# EAGLE design weatherstationv2 (EAGLE 6.0)
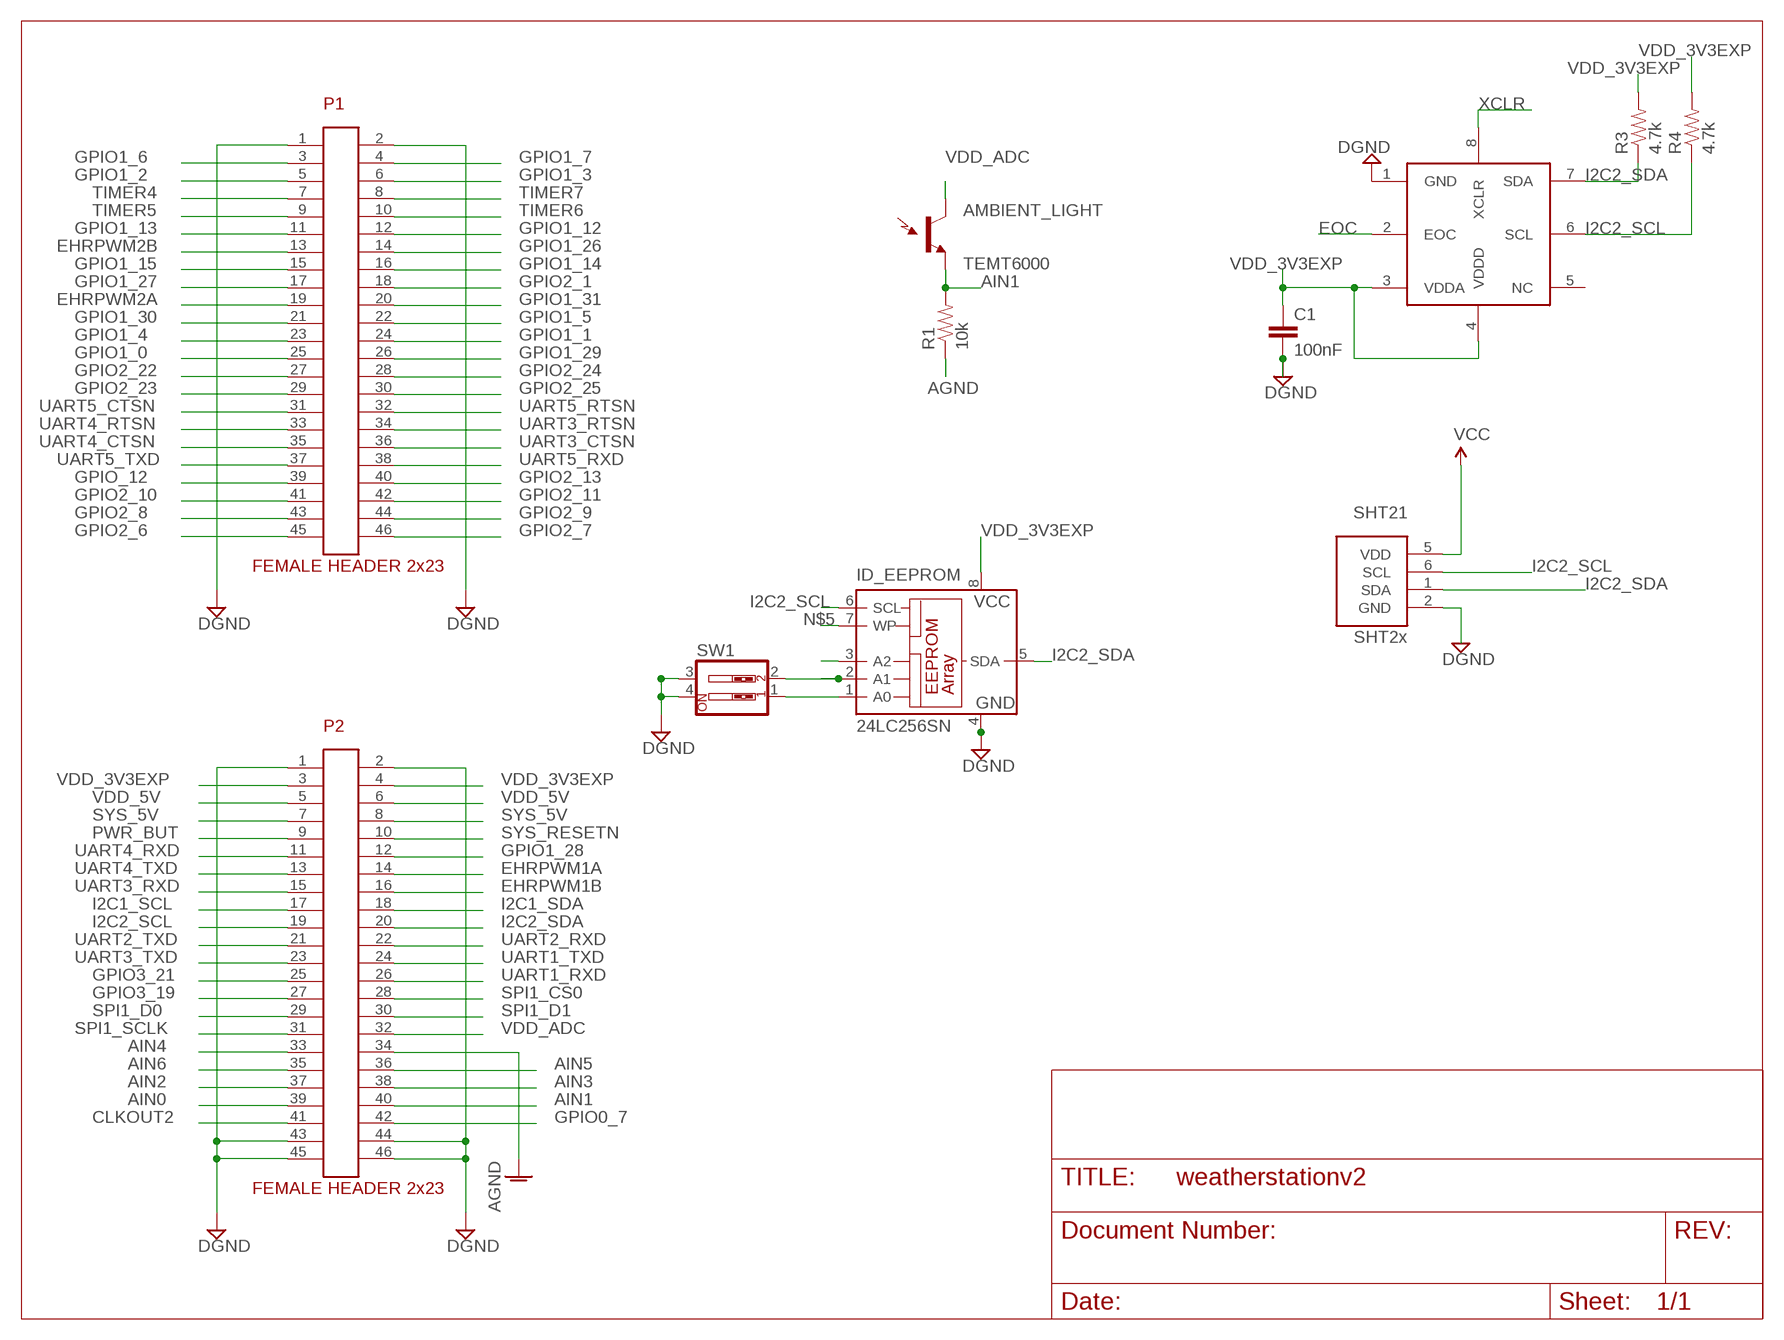
[diagram p0: schematic, sheet 1]

## Parts
AMBIENT_LIGHT  TEMT6000  [TEMT6000-SEN]
BAROMETRIC_PRESSURE  BMP085  [BMP085]
C1  100nF  CAP0603-CAP  [0603-CAP]
ID_EEPROM  24LC256SN  [SO-08]
P1  CONN23-2F  [CONN23-2F]
P2  CONN23-2FB  [CONN23-2F]
R1  10k  RESISTOR0805-RES  [0805]
R3  4.7k  RESISTOR0603-RES  [0603-RES]
R4  4.7k  RESISTOR0603-RES  [0603-RES]
SHT21  SHT2x  SHT21  [SHT21]
SW1  SW_DIP-2  [DIPSWITCH-02]

## Nets
AGND: P2.34 R1.1
AIN0: P2.39
AIN1: AMBIENT_LIGHT.EMITTER(E1) P2.40 R1.2
AIN2: P2.37
AIN3: P2.38
AIN4: P2.33
AIN5: P2.36
AIN6: P2.35
CLKOUT2: P2.41
DGND [power]: BAROMETRIC_PRESSURE.1(GND) C1.2 P1.1 P1.2 P2.1 P2.2 P2.43 P2.44 P2.45 P2.46 SHT21.2(GND) SW1.3 SW1.4
EHRPWM1A: P2.14
EHRPWM1B: P2.16
EHRPWM2A: P1.19
EHRPWM2B: P1.13
EOC: BAROMETRIC_PRESSURE.2(EOC)
GPIO0_7: P2.42
GPIO1_0: P1.25
GPIO1_1: P1.24
GPIO1_2: P1.5
GPIO1_3: P1.6
GPIO1_4: P1.23
GPIO1_5: P1.22
GPIO1_6: P1.3
GPIO1_7: P1.4
GPIO1_12: P1.12
GPIO1_13: P1.11
GPIO1_14: P1.16
GPIO1_15: P1.15
GPIO1_26: P1.14
GPIO1_27: P1.17
GPIO1_28: P2.12
GPIO1_29: P1.26
GPIO1_30: P1.21
GPIO1_31: P1.20
GPIO2_1: P1.18
GPIO2_6: P1.45
GPIO2_7: P1.46
GPIO2_8: P1.43
GPIO2_9: P1.44
GPIO2_10: P1.41
GPIO2_11: P1.42
GPIO2_13: P1.40
GPIO2_22: P1.27
GPIO2_23: P1.29
GPIO2_24: P1.28
GPIO2_25: P1.30
GPIO3_19: P2.27
GPIO3_21: P2.25
GPIO_12: P1.39
I2C1_SCL: P2.17
I2C1_SDA: P2.18
I2C2_SCL: BAROMETRIC_PRESSURE.6(SCL) ID_EEPROM.6(SCL) P2.19 R4.1 SHT21.6(SCL)
I2C2_SDA: BAROMETRIC_PRESSURE.7(SDA) ID_EEPROM.5(SDA) P2.20 R3.1 SHT21.1(SDA)
N$1: ID_EEPROM.1(A0) SW1.1
N$5: ID_EEPROM.7(WP)
N$6: ID_EEPROM.3(A2)
N$7: ID_EEPROM.2(A1) SW1.2
PWR_BUT: P2.9
SPI1_CS0: P2.28
SPI1_D0: P2.29
SPI1_D1: P2.30
SPI1_SCLK: P2.31
SYS_5V: P2.7 P2.8
SYS_RESETN: P2.10
TIMER4: P1.7
TIMER5: P1.9
TIMER6: P1.10
TIMER7: P1.8
UART1_RXD: P2.26
UART1_TXD: P2.24
UART2_RXD: P2.22
UART2_TXD: P2.21
UART3_CTSN: P1.36
UART3_RTSN: P1.34
UART3_RXD: P2.15
UART3_TXD: P2.23
UART4_CTSN: P1.35
UART4_RTSN: P1.33
UART4_RXD: P2.11
UART4_TXD: P2.13
UART5_CTSN: P1.31
UART5_RTSN: P1.32
UART5_RXD: P1.38
UART5_TXD: P1.37
VDD_3V3EXP [power]: BAROMETRIC_PRESSURE.3(VDDA) BAROMETRIC_PRESSURE.4(VDDD) C1.1 ID_EEPROM.8(VCC) P2.3 P2.4 R3.2 R4.2 SHT21.5(VDD) ; supply symbol labelled VCC
VDD_5V: P2.5 P2.6
VDD_ADC [power]: AMBIENT_LIGHT.COLLECTOR(C1) P2.32
XCLR: BAROMETRIC_PRESSURE.8(XCLR)
Unconnected: BAROMETRIC_PRESSURE.5(NC)

## Power pins joined to a net without a drawn wire
DGND: ID_EEPROM.4(GND)

## Library data of the parts
AMBIENT_LIGHT = SparkFun:TEMT6000: Ambient Light Sensor Simple light detection sensor. Output varies with light intensity input. Spark Fun Electronics SKU : COM-08348
BAROMETRIC_PRESSURE = SparkFun:BMP085
C1 = SparkFun:CAP: Capacitor Standard 0603 ceramic capacitor, and 0.1" leaded capacitor.
ID_EEPROM = microchip:24*: Serial EEPROM I2C; MF: MICROCHIP; MPN: 24LC256-I/SN; OC_FARNELL: 9757996; OC_NEWARK: 27C9144
P1 = conn23-2f:CONN23-2F: CONN23-2F 23x2 pin female header
P2 = conn23-2f:CONN23-2FB: CONN23-2FB 2x23 pin female header
R1 R3 R4 = SparkFun:RESISTOR: Resistor Basic schematic elements and footprints for 0603, 1206, and PTH resistors.
SHT21 = ALX:SHT21
SW1 = SparkFun:SW_DIP-2: DIP SWITCH

## Net classes
1 power: width 0.61 mm

## Board
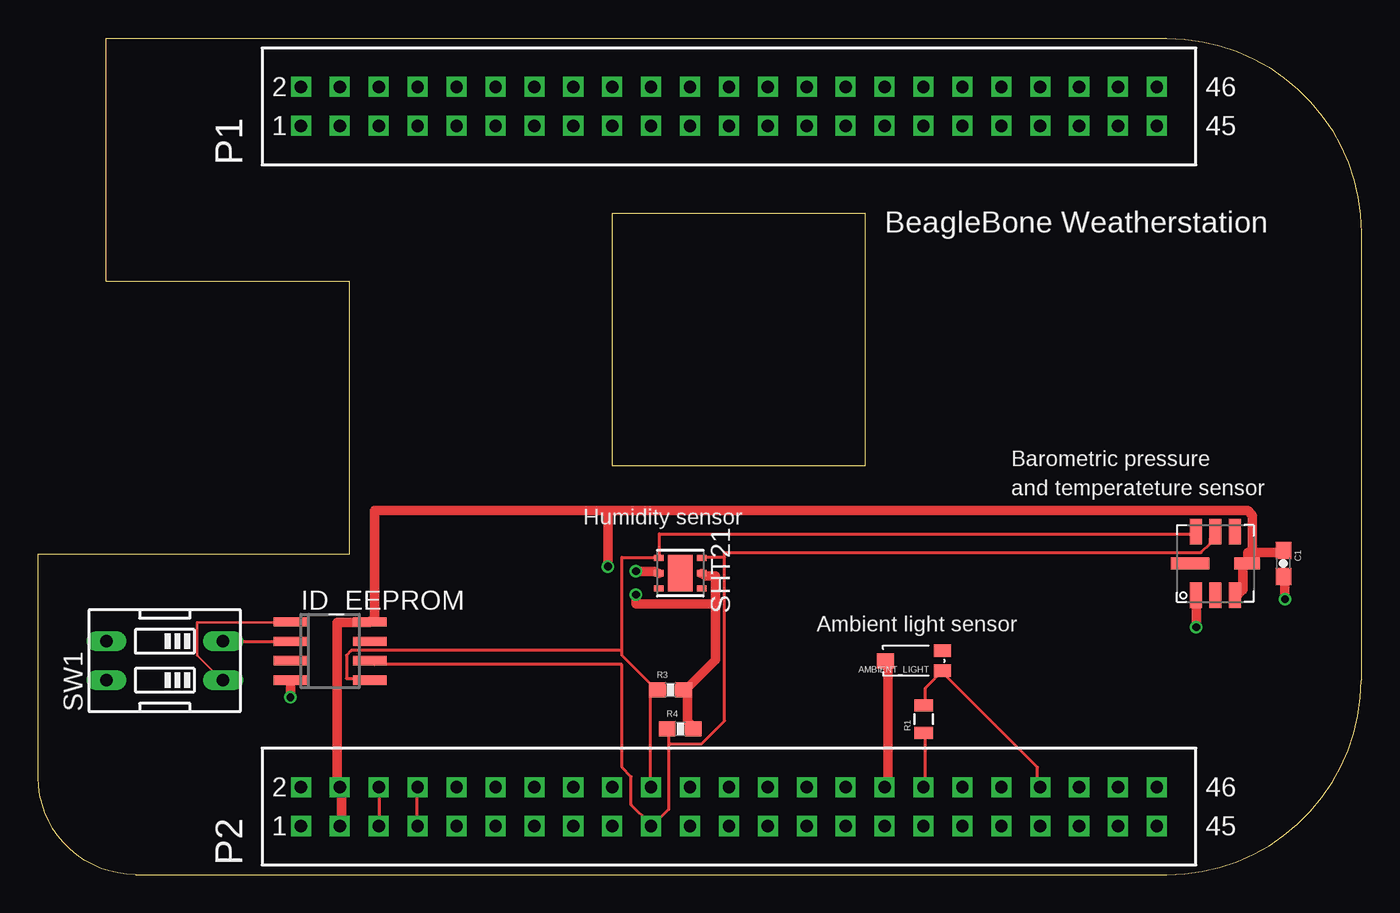
[diagram p1: board, top side]
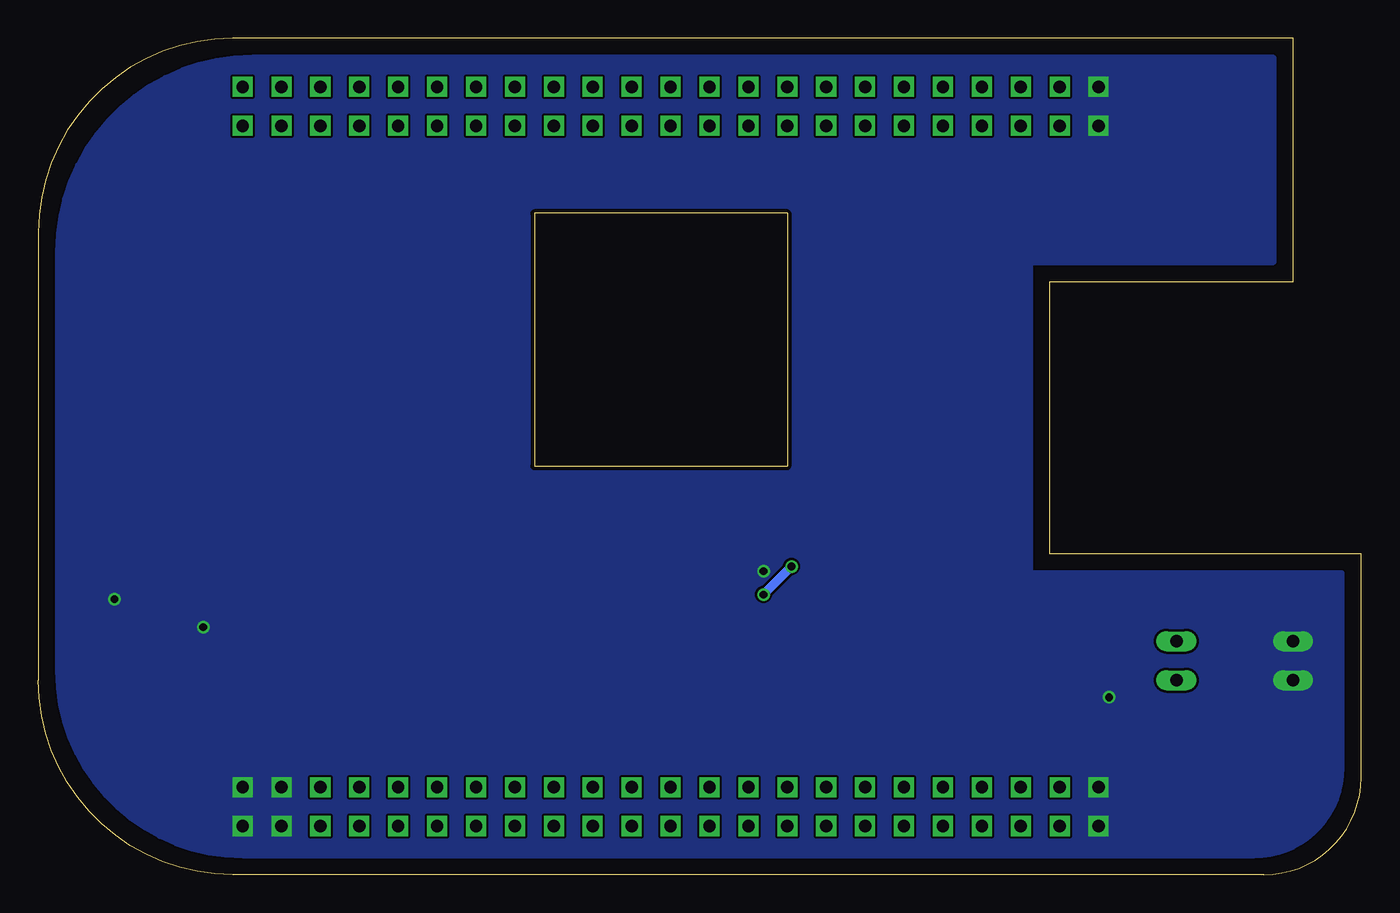
[diagram p2: board, bottom side, seen from below]

Size 86.36 x 54.61 mm. Coordinates in mm from the lower left corner, seen from the top.
Outline: 73.66,0 arc90 86.36,12.7 86.36,41.91 arc90 73.66,54.61 4.45,54.61 4.45,38.73 20.32,38.73 20.32,20.95 0,20.95 0,6.35 arc90 6.35,0 73.66,0
Outline: 37.47,43.18 53.98,43.18 53.98,26.67 37.47,26.67 37.47,43.18
Copper layers (1*16): Top 0.035mm / dielectric 1.5mm / Bottom 0.035mm
Design rules: minimum track width 6mil, minimum drill 12mil, track to track 6mil, track to pad 6mil, pad to pad 6mil, via to via 6mil, smd to smd 0mil, copper to edge 10mil, drill to drill 10mil, minimum pad ring 10mil, minimum via ring 6mil, stop-mask expansion 2mil, vias tented up to drill 100mil, thermal gap 10mil

### Footprints (pad centres in the part's own frame; a part is rotated, then mirrored left to right if it is on the bottom)
TEMT6000-SEN = smd 1.1 x 0.8: BASE -1.87,-0.65; EMITTER -1.87,0.65 | smd 1.1 x 1: COLLECTOR 1.86,0.01
BMP085 = smd 1.67 x 0.8: 1 -2.065,1.27; 2 -2.065,0; 3 -2.065,-1.27; 5 2.065,-1.27; 6 2.065,0; 7 2.065,1.27 | smd 0.8 x 1.67: 4 0,-2.065 | smd 0.8 x 2.5: 8 0,1.65
0603-CAP = smd 1.1 x 1: 1 -0.85,0; 2 0.85,0
SO-08 = smd 0.6 x 2.2: 1 -1.905,-2.6; 2 -0.635,-2.6; 3 0.635,-2.6; 4 1.905,-2.6; 5 1.905,2.6; 6 0.635,2.6; 7 -0.635,2.6; 8 -1.905,2.6
CONN23-2F = drill 0.8 square: 1 -1.27,27.94; 2 1.27,27.94; 3 -1.27,25.4; 4 1.27,25.4; 5 -1.27,22.86; 6 1.27,22.86; 7 -1.27,20.32; 8 1.27,20.32; 9 -1.27,17.78; 10 1.27,17.78; 11 -1.27,15.24; 12 1.27,15.24; 13 -1.27,12.7; 14 1.27,12.7; 15 -1.27,10.16; 16 1.27,10.16; 17 -1.27,7.62; 18 1.27,7.62; 19 -1.27,5.08; 20 1.27,5.08; 21 -1.27,2.54; 22 1.27,2.54; 23 -1.27,0; 24 1.27,0; 25 -1.27,-2.54; 26 1.27,-2.54; 27 -1.27,-5.08; 28 1.27,-5.08; 29 -1.27,-7.62; 30 1.27,-7.62; 31 -1.27,-10.16; 32 1.27,-10.16; 33 -1.27,-12.7; 34 1.27,-12.7; 35 -1.27,-15.24; 36 1.27,-15.24; 37 -1.27,-17.78; 38 1.27,-17.78; 39 -1.27,-20.32; 40 1.27,-20.32; 41 -1.27,-22.86; 42 1.27,-22.86; 43 -1.27,-25.4; 44 1.27,-25.4; 45 -1.27,-27.94; 46 1.27,-27.94
0805 = smd 0.8 x 1.2: 1 -0.9,0; 2 0.9,0
0603-RES = smd 1.1 x 1: 1 -0.85,0; 2 0.85,0
SHT21 = smd 0.4 x 0.6: 1 -1,-1.4; 2 0,-1.4; 3 1,-1.4; 4 1,1.4; 5 0,1.4; 6 -1,1.4 | smd 2.4 x 1.6: P$7 0,0
DIPSWITCH-02 = drill 0.813 long: 1 -1.27,-3.81; 2 1.27,-3.81; 3 1.27,3.81; 4 -1.27,3.81

### Placement (x,y rotation side)
AMBIENT_LIGHT  57.15,13.97 180 top
BAROMETRIC_PRESSURE  76.83,20.32 90 top
C1  81.28,20.32 270 top
ID_EEPROM  19.05,14.61 270 top
P1  45.09,50.16 90 top
P2  45.09,4.45 90 top
R1  57.78,10.16 90 top
R3  41.27,12.06 0 top
R4  41.91,9.53 0 top
SHT21  41.91,19.68 270 top
SW1  8.26,13.97 90 top

### Tracks (layer width: path | path; a pad name or v marks a point on that pad's centre or on a via)
AGND
  Top 0.203: R1.1 57.91,9.14 57.91,5.79 P2.34
AIN1
  Top 0.203: R1.2 57.91,11.28 57.91,12.19 58.83,13.11 AMBIENT_LIGHT.EMITTER 59.13,13.11 65.23,7.01 65.23,5.79 P2.40
DGND  (via drill 0.51)
  Top 0.61: v39.01,19.81 40.23,19.81 SHT21.2 | v81.38,17.98 81.38,19.2 C1.2 | v75.59,16.15 75.59,17.98 BAROMETRIC_PRESSURE.1 | v16.46,11.58 16.46,12.5 ID_EEPROM.4
  pour Bottom (no thermals): 5.71,40.01 5.71,53.34 72.39,53.34 arc-90 85.09,40.64 85.09,13.34 arc-90 73.03,1.27 6.99,1.27 arc-90 1.27,6.99 1.27,19.68 21.59,19.68 21.59,40.01
I2C2_SCL
  Top 0.203: ID_EEPROM.6 21.95,13.72 38.1,13.72 38.1,7.01 38.71,6.4 38.71,4.57 39.93,3.35 P2.19 40.23,3.35 41.15,4.27 41.15,8.53 | 44.81,20.73 43.59,20.73 SHT21.6 | 44.81,20.73 44.81,10.06 43.28,8.53 41.15,8.53 | 41.15,8.53 41.15,9.45 R4.1 | 44.81,20.73 44.81,21.03 75.89,21.03 76.5,21.64 76.5,21.95 76.81,22.25 BAROMETRIC_PRESSURE.6
I2C2_SDA
  Top 0.203: 38.1,14.63 38.1,14.33 39.93,12.5 | 38.1,14.63 38.1,20.73 40.23,20.73 SHT21.1 40.54,20.73 40.54,22.25 75.29,22.25 BAROMETRIC_PRESSURE.7 | 39.93,12.5 40.23,12.19 R3.1 39.93,12.5 | 38.1,14.63 20.42,14.63 20.12,14.33 20.12,12.8 21.64,12.8 ID_EEPROM.5 | 39.93,12.5 39.93,5.79 P2.20
N$1
  Top 0.152: 16.15,16.46 10.36,16.46 10.36,14.33 11.89,12.8 SW1.1
  Top 0.203: 16.15,16.46 ID_EEPROM.1
N$7
  Top 0.203: SW1.2 ID_EEPROM.2
SYS_5V
  Top 0.203: P2.7 24.69,3.35 24.69,5.49 P2.8
VDD_3V3EXP  (via drill 0.51)
  Top 0.61: 44.2,17.68 44.2,14.02 42.37,12.19 R3.2 42.37,11.89 42.37,10.06 42.67,9.75 R4.2 | 44.2,17.68 44.2,19.51 43.59,19.51 SHT21.5 | 79.25,21.03 78.94,21.03 78.94,20.42 BAROMETRIC_PRESSURE.4 78.64,20.12 78.64,18.59 78.33,18.29 BAROMETRIC_PRESSURE.3 | 79.25,21.03 81.08,21.03 C1.1 | P2.3 19.81,3.35 19.81,5.49 P2.4 19.51,5.79 19.51,16.46 21.64,16.46 ID_EEPROM.8 21.95,16.76 21.95,23.77 37.19,23.77 | 79.25,21.03 79.25,23.47 78.94,23.77 37.19,23.77 | 44.2,17.68 39.01,17.68 v39.01,18.29 | 37.19,23.77 v37.19,20.12
  Bottom 0.61: v37.19,20.12 v39.01,18.29
VDD_5V
  Top 0.203: P2.5 22.25,3.35 22.25,5.49 P2.6
VDD_ADC
  Top 0.61: AMBIENT_LIGHT.COLLECTOR 55.47,13.72 55.47,5.79 P2.32

### Text on the board
tPlace: 2 | 46 | 1 | 45 | BeagleBone Weatherstation | Barometric pressure | and temperateture sensor | Humidity sensor | Ambient light sensor | 2 | 46 | 1 | 45